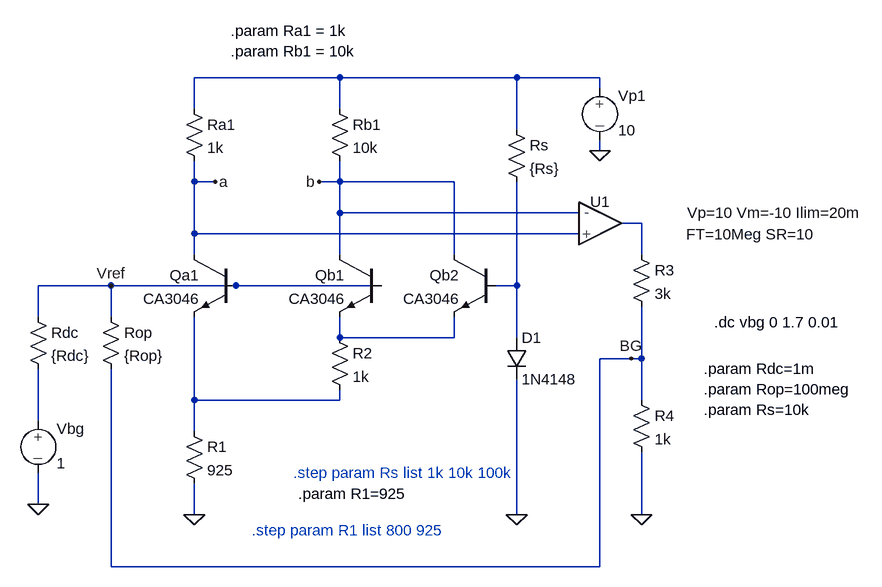
[diagram p0: schematic transistorzelle_mit_startsch.asc]
transistorzelle_mit_startsch.asc, the LTspice schematic file:
Version 4
SHEET 1 880 680
WIRE -272 -256 -496 -256
WIRE 0 -256 -272 -256
WIRE 128 -256 0 -256
WIRE 128 -240 128 -256
WIRE -496 -208 -496 -256
WIRE -272 -208 -272 -256
WIRE 0 -176 0 -256
WIRE 128 -144 128 -160
WIRE -496 -96 -496 -128
WIRE -464 -96 -496 -96
WIRE -272 -96 -272 -128
WIRE -272 -96 -304 -96
WIRE -96 -96 -272 -96
WIRE -272 -48 -272 -96
WIRE 96 -48 -272 -48
WIRE 192 -32 160 -32
WIRE -496 -16 -496 -96
WIRE 96 -16 -496 -16
WIRE -496 16 -496 -16
WIRE -272 16 -272 -48
WIRE -96 16 -96 -96
WIRE 192 16 192 -32
WIRE -624 64 -736 64
WIRE -432 64 -624 64
WIRE -208 64 -432 64
WIRE 0 64 0 -96
WIRE 0 64 -32 64
WIRE -736 112 -736 64
WIRE -624 112 -624 64
WIRE -272 144 -272 112
WIRE -96 144 -96 112
WIRE -96 144 -272 144
WIRE 0 144 0 64
WIRE 176 176 128 176
WIRE 192 176 192 96
WIRE 192 176 176 176
WIRE -496 240 -496 112
WIRE -272 240 -272 224
WIRE -272 240 -496 240
WIRE 192 240 192 176
WIRE -736 272 -736 192
WIRE -496 288 -496 240
WIRE -736 400 -736 352
WIRE -496 416 -496 368
WIRE 0 416 0 208
WIRE 192 416 192 320
WIRE -624 496 -624 192
WIRE 128 496 128 176
WIRE 128 496 -624 496
FLAG -496 416 0
FLAG 128 -144 0
FLAG -736 400 0
FLAG -464 -96 a
FLAG -304 -96 b
FLAG 0 416 0
FLAG 192 416 0
FLAG 176 176 BG
FLAG -624 64 Vref
SYMBOL EIT_Semiconductors\\npn -432 16 M0
SYMATTR InstName Qa1
SYMATTR Value CA3046
SYMBOL EIT_Semiconductors\\npn -208 16 M0
SYMATTR InstName Qb1
SYMATTR Value CA3046
SYMBOL res -512 -224 R0
SYMATTR InstName Ra1
SYMATTR Value 1k
SYMBOL res -288 -224 R0
SYMATTR InstName Rb1
SYMATTR Value 10k
SYMBOL res -288 128 R0
SYMATTR InstName R2
SYMATTR Value 1k
SYMBOL res -512 272 R0
SYMATTR InstName R1
SYMATTR Value 925
SYMBOL source-V -736 256 R0
WINDOW 123 0 0 Left 0
WINDOW 39 0 0 Left 0
SYMATTR InstName Vbg
SYMATTR Value 1
SYMBOL source-V 128 -256 R0
WINDOW 123 0 0 Left 0
WINDOW 39 0 0 Left 0
SYMATTR InstName Vp1
SYMATTR Value 10
SYMBOL EIT_Semiconductors\\npn -32 16 M0
SYMATTR InstName Qb2
SYMATTR Value CA3046
SYMBOL res -16 -192 R0
SYMATTR InstName Rs
SYMATTR Value {Rs}
SYMBOL diode -16 144 R0
SYMATTR InstName D1
SYMATTR Value 1N4148
SYMBOL EIT_Semiconductors\\op_3 128 -32 R0
WINDOW 123 133 17 Left 0
WINDOW 3 134 -16 Left 0
SYMATTR InstName U1
SYMBOL res 176 0 R0
SYMATTR InstName R3
SYMATTR Value 3k
SYMBOL res 176 224 R0
SYMATTR InstName R4
SYMATTR Value 1k
SYMBOL res -640 96 R0
SYMATTR InstName Rop
SYMATTR Value {Rop}
SYMBOL res -752 96 R0
SYMATTR InstName Rdc
SYMATTR Value {Rdc}
TEXT 304 120 Left 0 !.dc vbg 0 1.7 0.01
TEXT 288 192 Left 0 !.param Rdc=1m\n.param Rop=100meg\n.param Rs=10k
TEXT -344 352 Left 0 ;.step param Rs list 1k 10k 100k
TEXT -336 384 Left 0 !.param R1=925
TEXT -408 440 Left 0 ;.step param R1 list 800 925
TEXT -440 -328 Left 0 !.param Ra1 = 1k\n.param Rb1 = 10k

The netlist it stands for:
* transistorzelle_mit_startsch.asc
Qa1 a Vref N005 0 CA3046
Qb1 b Vref N004 0 CA3046
Ra1 N001 a 1k
Rb1 N001 b 10k
R2 N004 N005 1k
R1 N005 0 925
Vbg N006 0 1
Vp1 N001 0 10
Qb2 b N003 N004 0 CA3046
Rs N001 N003 {Rs}
D1 N003 0 1N4148
XU1 a b N002 opamp_param_3 Vp=10 Vm=-10 Ilim=20m FT=10Meg SR=10 Vos=0 A0=100k phir=45 en=0 enk=0 in=0 ink=0 Rin=500Meg  ; pins In+ In- OUT
R3 N002 BG 3k
R4 BG 0 1k
Rop Vref BG {Rop}
Rdc Vref N006 {Rdc}
.model D D
.lib standard.dio
.model NPN NPN
.model PNP PNP
.lib standard.bjt
.dc vbg 0 1.7 0.01
.param Rdc=1m
.param Rop=100meg
.param Rs=10k
* .step param Rs list 1k 10k 100k
.param R1=925
* .step param R1 list 800 925
.param Ra1 = 1k
.param Rb1 = 10k
.lib EIT_sub\opamp_parametrierbar.sub
.backanno
.end